# Altium project HIVE_BOARD.PrjPcb (part 2 of 6)

## Sheet HIVE_BOARD_MCU.SchDoc
size Tabloid; DocumentNumber: 2; SheetNumber: 5; SheetTotal: 12; Sheet_Name: MCU; Size: 11x17
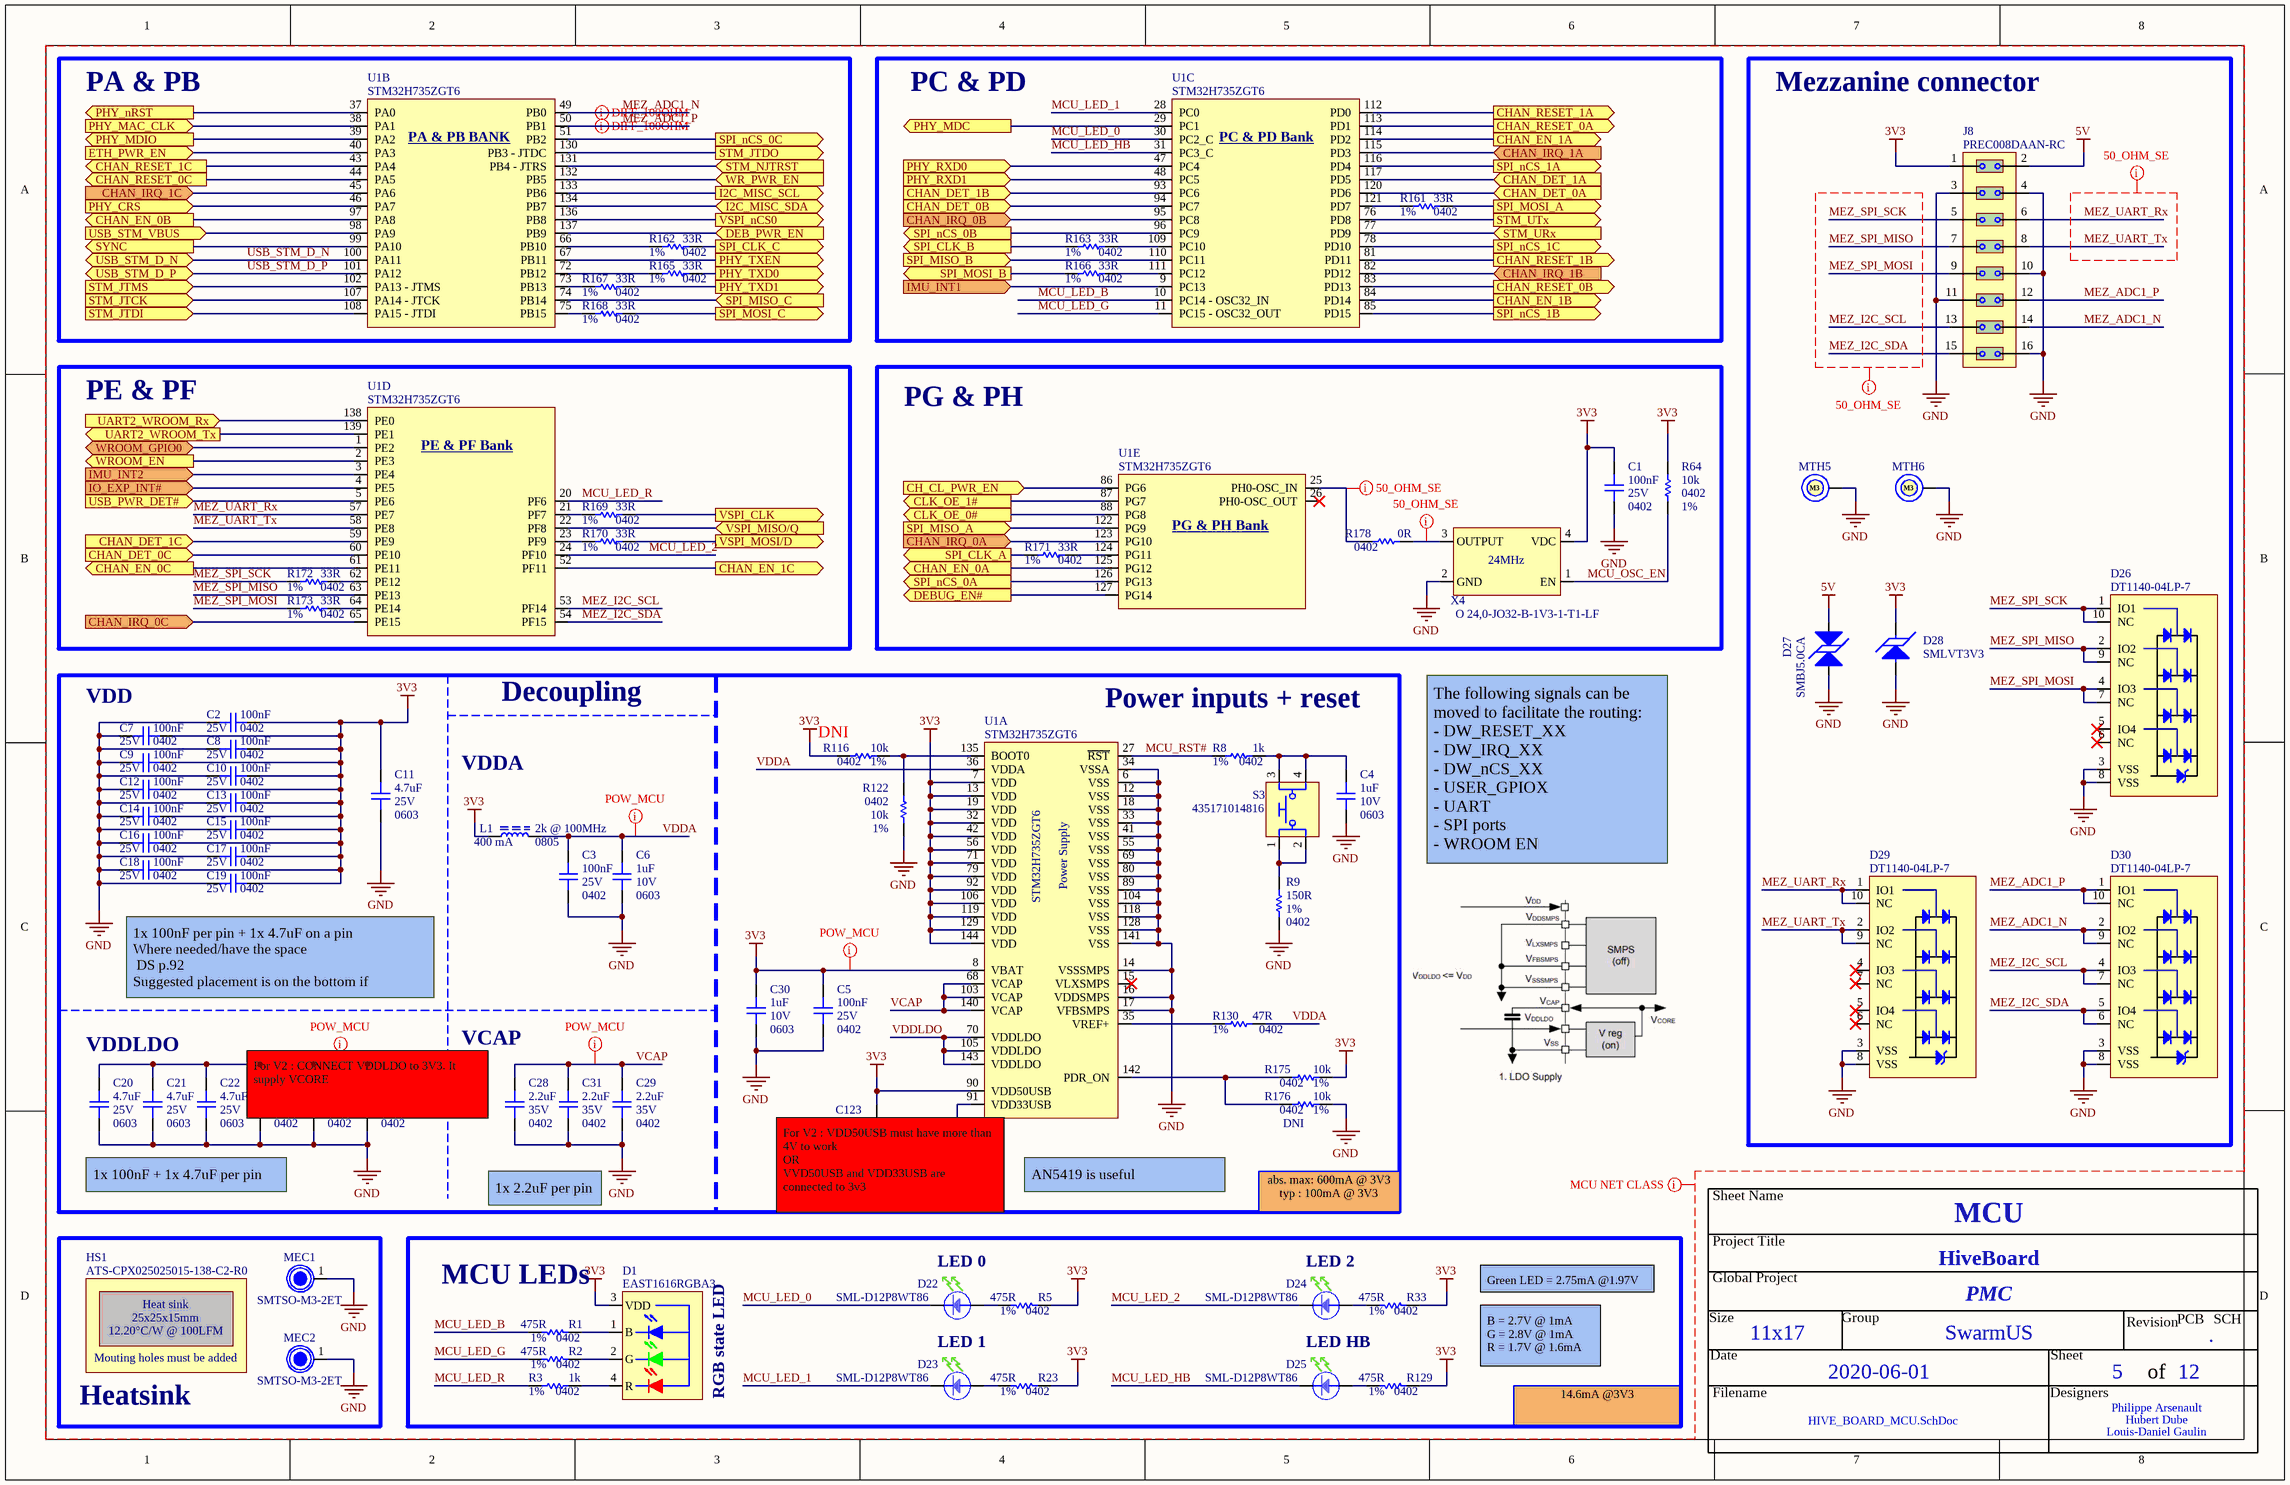
[diagram p2: HIVE_BOARD_MCU.SchDoc]

### Parts
C1  value 100nF  Package: 0402  Voltage Rating: 25V  [CAP_CER_0402]  (hidden comment: CGA2B3X7R1E104K050BB)
C2  value 100nF  Package: 0402  Voltage Rating: 25V  [CAP_CER_0402]  (hidden comment: CGA2B3X7R1E104K050BB)
C3  value 100nF  Package: 0402  Voltage Rating: 25V  [CAP_CER_0402]  (hidden comment: CGA2B3X7R1E104K050BB)
C4  value 1uF  Package: 0603  Voltage Rating: 10V  [CAP_CER_0603]  (hidden comment: C0603C105K8PACTU)
C5  value 100nF  Package: 0402  Voltage Rating: 25V  [CAP_CER_0402]  (hidden comment: CGA2B3X7R1E104K050BB)
C6  value 1uF  Package: 0603  Voltage Rating: 10V  [CAP_CER_0603]  (hidden comment: C0603C105K8PACTU)
C7  value 100nF  Package: 0402  Voltage Rating: 25V  [CAP_CER_0402]  (hidden comment: CGA2B3X7R1E104K050BB)
C8  value 100nF  Package: 0402  Voltage Rating: 25V  [CAP_CER_0402]  (hidden comment: CGA2B3X7R1E104K050BB)
C9  value 100nF  Package: 0402  Voltage Rating: 25V  [CAP_CER_0402]  (hidden comment: CGA2B3X7R1E104K050BB)
C10  value 100nF  Package: 0402  Voltage Rating: 25V  [CAP_CER_0402]  (hidden comment: CGA2B3X7R1E104K050BB)
C11  value 4.7uF  Package: 0603  Voltage Rating: 25V  [CAP_CER_0603]  (hidden comment: CL10A475MA8NQNC)
C12  value 100nF  Package: 0402  Voltage Rating: 25V  [CAP_CER_0402]  (hidden comment: CGA2B3X7R1E104K050BB)
C13  value 100nF  Package: 0402  Voltage Rating: 25V  [CAP_CER_0402]  (hidden comment: CGA2B3X7R1E104K050BB)
C14  value 100nF  Package: 0402  Voltage Rating: 25V  [CAP_CER_0402]  (hidden comment: CGA2B3X7R1E104K050BB)
C15  value 100nF  Package: 0402  Voltage Rating: 25V  [CAP_CER_0402]  (hidden comment: CGA2B3X7R1E104K050BB)
C16  value 100nF  Package: 0402  Voltage Rating: 25V  [CAP_CER_0402]  (hidden comment: CGA2B3X7R1E104K050BB)
C17  value 100nF  Package: 0402  Voltage Rating: 25V  [CAP_CER_0402]  (hidden comment: CGA2B3X7R1E104K050BB)
C18  value 100nF  Package: 0402  Voltage Rating: 25V  [CAP_CER_0402]  (hidden comment: CGA2B3X7R1E104K050BB)
C19  value 100nF  Package: 0402  Voltage Rating: 25V  [CAP_CER_0402]  (hidden comment: CGA2B3X7R1E104K050BB)
C20  value 4.7uF  Package: 0603  Voltage Rating: 25V  [CAP_CER_0603]  (hidden comment: CL10A475MA8NQNC)
C21  value 4.7uF  Package: 0603  Voltage Rating: 25V  [CAP_CER_0603]  (hidden comment: CL10A475MA8NQNC)
C22  value 4.7uF  Package: 0603  Voltage Rating: 25V  [CAP_CER_0603]  (hidden comment: CL10A475MA8NQNC)
C23  value 100nF  Package: 0402  Voltage Rating: 25V  [CAP_CER_0402]  (hidden comment: CGA2B3X7R1E104K050BB)
C24  value 100nF  Package: 0402  Voltage Rating: 25V  [CAP_CER_0402]  (hidden comment: CGA2B3X7R1E104K050BB)
C25  value 100nF  Package: 0402  Voltage Rating: 25V  [CAP_CER_0402]  (hidden comment: CGA2B3X7R1E104K050BB)
C28  value 2.2uF  Package: 0402  Voltage Rating: 35V  [CAP_CER_0402]  (hidden comment: C1005X5R1V225K050BC)
C29  value 2.2uF  Package: 0402  Voltage Rating: 35V  [CAP_CER_0402]  (hidden comment: C1005X5R1V225K050BC)
C30  value 1uF  Package: 0603  Voltage Rating: 10V  [CAP_CER_0603]  (hidden comment: C0603C105K8PACTU)
C31  value 2.2uF  Package: 0402  Voltage Rating: 35V  [CAP_CER_0402]  (hidden comment: C1005X5R1V225K050BC)
C123  value 4.7uF  Package: 0603  Voltage Rating: 25V  [CAP_CER_0603]  (hidden comment: CL10A475MA8NQNC)
D1  EAST1616RGBA3  [DIO_EAST1616RGBA3]
D22  SML-D12P8WT86  [LED_SML-D12P8WT86]
D23  SML-D12P8WT86  [LED_SML-D12P8WT86]
D24  SML-D12P8WT86  [LED_SML-D12P8WT86]
D25  SML-D12P8WT86  [LED_SML-D12P8WT86]
D26  DT1140-04LP-7  [TVS_DATA_DT1140-04LP-7]
D27  SMBJ5.0CA  [TVS_PWR_SMBJ5.0CA]
D28  SMLVT3V3  [TVS_POW_SMLVT3V3]
D29  DT1140-04LP-7  [TVS_DATA_DT1140-04LP-7]
D30  DT1140-04LP-7  [TVS_DATA_DT1140-04LP-7]
HS1  ATS-CPX025025015-138-C2-R0  [THE_HS_ATS-CPX025025015-138-C2-R0_NOMH]
J8  PREC008DAAN-RC  [CON_HDR_PREC008DAAN-RC]
L1  value 2k @ 100MHz  Current Rating: 400 mA  Package: 0805  [FER_0805]  (hidden comment: MMZ2012Y202BT000)
MEC1  SMTSO-M3-2ET  [MEC_PEM_SMTSO-M3-2ET]
MEC2  SMTSO-M3-2ET  [MEC_PEM_SMTSO-M3-2ET]
MTH5  M3  [MTH_M3]  (no BOM)
MTH6  M3  [MTH_M3]  (no BOM)
R1  value 475R  Tolerance: 1%  Package: 0402  [RES_0402]  (hidden comment: ERJ-2RKF4750X)
R2  value 475R  Tolerance: 1%  Package: 0402  [RES_0402]  (hidden comment: ERJ-2RKF4750X)
R3  value 1k  Tolerance: 1%  Package: 0402  [RES_0402]  (hidden comment: RC0402FR-071KL)
R5  value 475R  Tolerance: 1%  Package: 0402  [RES_0402]  (hidden comment: ERJ-2RKF4750X)
R8  value 1k  Tolerance: 1%  Package: 0402  [RES_0402]  (hidden comment: RC0402FR-071KL)
R9  value 150R  Tolerance: 1%  Package: 0402  [RES_0402]  (hidden comment: RC0402FR-07150RL)
R23  value 475R  Tolerance: 1%  Package: 0402  [RES_0402]  (hidden comment: ERJ-2RKF4750X)
R33  value 475R  Tolerance: 1%  Package: 0402  [RES_0402]  (hidden comment: ERJ-2RKF4750X)
R64  value 10k  Tolerance: 1%  Package: 0402  [RES_0402]  (hidden comment: RC0402FR-0710KL)
R116  value 10k  Tolerance: 1%  Assembly Note: DNI  Package: 0402  [RES_0402]  (hidden comment: RC0402FR-0710KL)
R122  value 10k  Tolerance: 1%  Package: 0402  [RES_0402]  (hidden comment: RC0402FR-0710KL)
R129  value 475R  Tolerance: 1%  Package: 0402  [RES_0402]  (hidden comment: ERJ-2RKF4750X)
R130  value 47R  Tolerance: 1%  Package: 0402  [RES_0402]  (hidden comment: RC0402FR-0747RL)
R161  value 33R  Tolerance: 1%  Package: 0402  [RES_0402]  (hidden comment: RC0402FR-0733RL)
R162  value 33R  Tolerance: 1%  Package: 0402  [RES_0402]  (hidden comment: RC0402FR-0733RL)
R163  value 33R  Tolerance: 1%  Package: 0402  [RES_0402]  (hidden comment: RC0402FR-0733RL)
R165  value 33R  Tolerance: 1%  Package: 0402  [RES_0402]  (hidden comment: RC0402FR-0733RL)
R166  value 33R  Tolerance: 1%  Package: 0402  [RES_0402]  (hidden comment: RC0402FR-0733RL)
R167  value 33R  Tolerance: 1%  Package: 0402  [RES_0402]  (hidden comment: RC0402FR-0733RL)
R168  value 33R  Tolerance: 1%  Package: 0402  [RES_0402]  (hidden comment: RC0402FR-0733RL)
R169  value 33R  Tolerance: 1%  Package: 0402  [RES_0402]  (hidden comment: RC0402FR-0733RL)
R170  value 33R  Tolerance: 1%  Package: 0402  [RES_0402]  (hidden comment: RC0402FR-0733RL)
R171  value 33R  Tolerance: 1%  Package: 0402  [RES_0402]  (hidden comment: RC0402FR-0733RL)
R172  value 33R  Tolerance: 1%  Package: 0402  [RES_0402]  (hidden comment: RC0402FR-0733RL)
R173  value 33R  Tolerance: 1%  Package: 0402  [RES_0402]  (hidden comment: RC0402FR-0733RL)
R175  value 10k  Tolerance: 1%  Package: 0402  [RES_0402]  (hidden comment: RC0402FR-0710KL)
R176  value 10k  Tolerance: 1%  Assembly Note: DNI  Package: 0402  [RES_0402]  (hidden comment: RC0402FR-0710KL)
R178  value 0R  Package: 0402  [RES_0402]  (hidden comment: RC0402FR-070RL)
S3  435171014816  [SWI_TACT_435171014816]
U1  STM32H735ZGT6  [MCU_STM32H735ZGT6]  (parts A,B,C,D,E of 5)
X4  O 24,0-JO32-B-1V3-1-T1-LF  [OSC_O 24,0-JO32-B-1V3-1-T1-LF]

### Blocks framed on the sheet
PA & PB: R162 R165 R167 R168 U1
PC & PD: R161 R163 R166 U1
Mezzanine connector: D26-D30 J8 MTH5 MTH6
PE & PF: R169 R170 R172 R173 U1
PG & PH: C1 R64 R171 R178 U1 X4
Heatsink: HS1 MEC1 MEC2
MCU LEDs: D1 D22-D25 R1-R3 R5 R23 R33 R129

### Ports
CH_CL_PWR_EN (in), CHAN_DET_0A (in), CHAN_DET_0B (in), CHAN_DET_0C (in), CHAN_DET_1A (in), CHAN_DET_1B (in), CHAN_DET_1C (in), CHAN_EN_0A (out), CHAN_EN_0B (out), CHAN_EN_0C (out), CHAN_EN_1A (out), CHAN_EN_1B (out), CHAN_EN_1C (out), CHAN_IRQ_0A (in), CHAN_IRQ_0B (in), CHAN_IRQ_0C (in), CHAN_IRQ_1A (in), CHAN_IRQ_1B (in), CHAN_IRQ_1C (in), CHAN_RESET_0A (out), CHAN_RESET_0B (out), CHAN_RESET_0C (out), CHAN_RESET_1A (out), CHAN_RESET_1B (out), CHAN_RESET_1C (out), CLK_OE_0# (out), CLK_OE_1# (out), DEB_PWR_EN (in), DEBUG_EN# (out), ETH_PWR_EN (in), I2C_MISC_SCL (out), I2C_MISC_SDA (bidir), IMU_INT1 (in), IMU_INT2 (in), IO_EXP_INT# (in), PHY_CRS (in), PHY_MAC_CLK (in), PHY_MDC (out), PHY_MDIO (out), PHY_nRST (out), PHY_RXD0 (in), PHY_RXD1 (in), PHY_TXD0 (out), PHY_TXD1 (out), PHY_TXEN (out), SPI_CLK_A (out), SPI_CLK_B (out), SPI_CLK_C (out), SPI_MISO_A (in), SPI_MISO_B (in), SPI_MISO_C (in), SPI_MOSI_A (out), SPI_MOSI_B (out), SPI_MOSI_C (out), SPI_nCS_0A (out), SPI_nCS_0B (out), SPI_nCS_0C (out), SPI_nCS_1A (out), SPI_nCS_1B (out), SPI_nCS_1C (out), STM_JTCK (in), STM_JTDI (in), STM_JTDO (out), STM_JTMS (in), STM_NJTRST (in), STM_URx (in), STM_UTx (out), SYNC (out), UART2_WROOM_Rx (in), UART2_WROOM_Tx (out), USB_PWR_DET# (in), USB_STM_D_N (bidir), USB_STM_D_P (bidir), USB_STM_VBUS (in), VSPI_CLK (out), VSPI_MISO/Q (in), VSPI_MOSI/D (out), VSPI_nCS0 (out), WR_PWR_EN (in), WROOM_EN (out), WROOM_GPIO0 (bidir)

### Nets
3V3: C1.2 C2.1 C5.2 C7.1 C8.1 C9.1 C10.1 C11.2 C12.1 C13.1 C14.1 C15.1 C16.1 C17.1 C18.1 C19.1 C30.1 C123.2 D1.3(VDD) D28.K J8.1 L1.1 R5.1 R23.1 R33.1 R64.1 R116.1 R129.1 R175.2 U1.7(VDD) U1.8(VBAT) U1.13(VDD) U1.19(VDD) U1.32(VDD) U1.42(VDD) U1.56(VDD) U1.71(VDD) U1.79(VDD) U1.90(VDD50USB) U1.92(VDD) U1.106(VDD) U1.119(VDD) U1.129(VDD) U1.144(VDD) X4.4(VDC)
5V: D27.1 J8.2
GND: C1.1 C2.2 C3.1 C4.2 C5.1 C6.2 C7.2 C8.2 C9.2 C10.2 C11.1 C12.2 C13.2 C14.2 C15.2 C16.2 C17.2 C18.2 C19.2 C20.1 C21.1 C22.1 C23.1 C24.1 C25.1 C28.1 C29.1 C30.2 C31.1 C123.1 D26.3(VSS) D26.8(VSS) D27.2 D28.A D29.3(VSS) D29.8(VSS) D30.3(VSS) D30.8(VSS) J8.3 J8.4 J8.10 J8.11 J8.16 MEC1.1 MEC2.1 MTH5.1 MTH6.1 R9.1 R122.2 R176.2 U1.6(VSS) U1.12(VSS) U1.14(VSSSMPS) U1.16(VDDSMPS) U1.17(VFBSMPS) U1.18(VSS) U1.33(VSS) U1.34(VSSA) U1.41(VSS) U1.55(VSS) U1.69(VSS) U1.80(VSS) U1.89(VSS) U1.91(VDD33USB) U1.104(VSS) U1.118(VSS) U1.128(VSS) U1.141(VSS) X4.2(GND)
CH_CL_PWR_EN: U1.86(PG6) ; port CH_CL_PWR_EN
CHAN_DET_0A: U1.120(PD6) ; port CHAN_DET_0A
CHAN_DET_0B: U1.94(PC7) ; port CHAN_DET_0B
CHAN_DET_0C: U1.60(PE10) ; port CHAN_DET_0C
CHAN_DET_1A: U1.117(PD5) ; port CHAN_DET_1A
CHAN_DET_1B: U1.93(PC6) ; port CHAN_DET_1B
CHAN_DET_1C: U1.59(PE9) ; port CHAN_DET_1C
CHAN_EN_0A: U1.125(PG12) ; port CHAN_EN_0A
CHAN_EN_0B: U1.97(PA8) ; port CHAN_EN_0B
CHAN_EN_0C: U1.61(PE11) ; port CHAN_EN_0C
CHAN_EN_1A: U1.114(PD2) ; port CHAN_EN_1A
CHAN_EN_1B: U1.84(PD14) ; port CHAN_EN_1B
CHAN_EN_1C: U1.52(PF11) ; port CHAN_EN_1C
CHAN_IRQ_0A: U1.123(PG10) ; port CHAN_IRQ_0A
CHAN_IRQ_0B: U1.95(PC8) ; port CHAN_IRQ_0B
CHAN_IRQ_0C: U1.65(PE15) ; port CHAN_IRQ_0C
CHAN_IRQ_1A: U1.115(PD3) ; port CHAN_IRQ_1A
CHAN_IRQ_1B: U1.82(PD12) ; port CHAN_IRQ_1B
CHAN_IRQ_1C: U1.45(PA6) ; port CHAN_IRQ_1C
CHAN_RESET_0A: U1.113(PD1) ; port CHAN_RESET_0A
CHAN_RESET_0B: U1.83(PD13) ; port CHAN_RESET_0B
CHAN_RESET_0C: U1.44(PA5) ; port CHAN_RESET_0C
CHAN_RESET_1A: U1.112(PD0) ; port CHAN_RESET_1A
CHAN_RESET_1B: U1.81(PD11) ; port CHAN_RESET_1B
CHAN_RESET_1C: U1.43(PA4) ; port CHAN_RESET_1C
CLK_OE_0#: U1.88(PG8) ; port CLK_OE_0#
CLK_OE_1#: U1.87(PG7) ; port CLK_OE_1#
DEB_PWR_EN: U1.132(PB5) ; port WR_PWR_EN
ETH_PWR_EN: U1.40(PA3) ; port ETH_PWR_EN
I2C_MISC_SCL: U1.133(PB6) ; port I2C_MISC_SCL
I2C_MISC_SDA: U1.134(PB7) ; port I2C_MISC_SDA
IMU_INT1: U1.9(PC13) ; port IMU_INT1
IMU_INT2: U1.3(PE4) ; port IMU_INT2
IO_EXP_INT#: U1.4(PE5) ; port IO_EXP_INT#
MCU_LED_0: D22.K U1.30(PC2_C)
MCU_LED_1: D23.K U1.28(PC0)
MCU_LED_2: D24.K U1.24(PF10)
MCU_LED_B: R1.2 U1.10(PC14_-_OSC32_IN)
MCU_LED_G: R2.2 U1.11(PC15_-_OSC32_OUT)
MCU_LED_HB: D25.K U1.31(PC3_C)
MCU_LED_R: R3.2 U1.20(PF6)
MCU_OSC_EN: R64.2 X4.1(EN)
MCU_RST#: R8.2 U1.27(~{RST})
MEZ_ADC1_N: D30.2(IO2) D30.9(NC) J8.14 U1.49(PB0)
MEZ_ADC1_P: D30.1(IO1) D30.10(NC) J8.12 U1.50(PB1)
MEZ_I2C_SCL: D30.4(IO3) D30.7(NC) J8.13 U1.53(PF14)
MEZ_I2C_SDA: D30.5(IO4) D30.6(NC) J8.15 U1.54(PF15)
MEZ_SPI_MISO: D26.2(IO2) D26.9(NC) J8.7 U1.63(PE13)
MEZ_SPI_MOSI: D26.4(IO3) D26.7(NC) J8.9 R173.2
MEZ_SPI_SCK: D26.1(IO1) D26.10(NC) J8.5 R172.2
MEZ_UART_Rx: D29.1(IO1) D29.10(NC) J8.6 U1.57(PE7)
MEZ_UART_Tx: D29.2(IO2) D29.9(NC) J8.8 U1.58(PE8)
PHY_nRST: U1.37(PA0) ; port PHY_nRST
SPI_CLK_A: R171.2 ; port SPI_CLK_A
SPI_CLK_B: R163.2 ; port SPI_CLK_B
SPI_CLK_C: R162.1 ; port SPI_CLK_C
SPI_MISO_A: U1.122(PG9) ; port SPI_MISO_A
SPI_MISO_B: U1.110(PC11) ; port SPI_MISO_B
SPI_MISO_C: U1.74(PB14) ; port SPI_MISO_C
SPI_MOSI_A: R161.1 ; port SPI_MOSI_A
SPI_MOSI_B: R166.2 ; port SPI_MOSI_B
SPI_MOSI_C: R168.1 ; port SPI_MOSI_C
SPI_nCS_0A: U1.126(PG13) ; port SPI_nCS_0A
SPI_nCS_0B: U1.96(PC9) ; port SPI_nCS_0B
SPI_nCS_0C: U1.51(PB2) ; port SPI_nCS_0C
SPI_nCS_1A: U1.116(PD4) ; port SPI_nCS_1A
SPI_nCS_1B: U1.85(PD15) ; port SPI_nCS_1B
SPI_nCS_1C: U1.78(PD10) ; port SPI_nCS_1C
USB_PWR_DET#: U1.5(PE6) ; port USB_PWR_DET#
USB_STM_D_N: U1.100(PA11) ; port USB_STM_D_N
USB_STM_D_P: U1.101(PA12) ; port USB_STM_D_P
VCAP: C28.2 C29.2 C31.2 U1.68(VCAP) U1.103(VCAP) U1.140(VCAP)
VDDA: C3.2 C6.1 L1.2 R130.1 U1.36(VDDA)
VDDLDO: C20.2 C21.2 C22.2 C23.2 C24.2 C25.2 U1.70(VDDLDO) U1.105(VDDLDO) U1.143(VDDLDO)
WR_PWR_EN: U1.137(PB9) ; port DEB_PWR_EN
NetC4_1: C4.1 R8.1 S3.3 S3.4
NetD1_1: D1.1(B) R1.1
NetD1_2: D1.2(G) R2.1
NetD1_4: D1.4(R) R3.1
NetD22_A: D22.A R5.2
NetD23_A: D23.A R23.2
NetD24_A: D24.A R33.2
NetD25_A: D25.A R129.2
NetJ7_2: U1.131(PB4_-_JTRS) ; port STM_NJTRST
NetJ7_4: U1.102(PA13_-_JTMS) ; port STM_JTMS
NetJ7_6: U1.130(PB3_-_JTDC) ; port STM_JTDO
NetJ7_8: U1.108(PA15_-_JTDI) ; port STM_JTDI
NetJ7_10: U1.107(PA14_-_JTCK) ; port STM_JTCK
NetR9_2: R9.2 S3.1 S3.2
NetR16_2: U1.98(PA9) ; port USB_STM_VBUS
NetR18_2: U1.47(PC4) ; port PHY_RXD0
NetR19_2: U1.48(PC5) ; port PHY_RXD1
NetR38_2: U1.2(PE3) ; port WROOM_EN
NetR45_1: U1.39(PA2) ; port PHY_MDIO
NetR47_2: U1.46(PA7) ; port PHY_CRS
NetR48_2: U1.38(PA1) ; port PHY_MAC_CLK
NetR65_1: U1.127(PG14) ; port DEBUG_EN#
NetR116_2: R116.2 R122.1 U1.135(BOOT0)
NetR130_2: R130.2 U1.35(VREF+)
NetR161_2: R161.2 U1.121(PD7)
NetR162_2: R162.2 U1.66(PB10)
NetR163_1: R163.1 U1.109(PC10)
NetR165_1: R165.1 ; port PHY_TXD0
NetR165_2: R165.2 U1.72(PB12)
NetR166_1: R166.1 U1.111(PC12)
NetR167_1: R167.1 ; port PHY_TXD1
NetR167_2: R167.2 U1.73(PB13)
NetR168_2: R168.2 U1.75(PB15)
NetR169_1: R169.1 ; port VSPI_CLK
NetR169_2: R169.2 U1.21(PF7)
NetR170_1: R170.1 ; port VSPI_MOSI/D
NetR170_2: R170.2 U1.23(PF9)
NetR171_1: R171.1 U1.124(PG11)
NetR172_1: R172.1 U1.62(PE12)
NetR173_1: R173.1 U1.64(PE14)
NetR175_1: R175.1 R176.1 U1.142(PDR_ON)
NetR178_1: R178.1 X4.3(OUTPUT)
NetR178_2: R178.2 U1.25(PH0-OSC_IN)
NetR179_2: U1.99(PA10) ; port SYNC
NetU1_1: U1.1(PE2) ; port WROOM_GPIO0
NetU1_22: U1.22(PF8) ; port VSPI_MISO/Q
NetU1_29: U1.29(PC1) ; port PHY_MDC
NetU1_67: U1.67(PB11) ; port PHY_TXEN
NetU1_76: U1.76(PD8) ; port STM_UTx
NetU1_77: U1.77(PD9) ; port STM_URx
NetU1_136: U1.136(PB8) ; port VSPI_nCS0
NetU1_138: U1.138(PE0) ; port UART2_WROOM_Rx
NetU1_139: U1.139(PE1) ; port UART2_WROOM_Tx

Not connected (* = marked no-connect by the designer): D26 5(IO4)* 6(NC)*; D29 4(IO3)* 5(IO4)* 6(NC)* 7(NC)*; U1 15(VLXSMPS)* 26(PH0-OSC_OUT)*

### Layout directives
net class POWER; net class POW_MCU: 3V3
net class POW_MCU: VCAP, VDDA, VDDLDO
net class NETS_MCU: 3V3, 5V, GND, MCU_LED_0, MCU_LED_1, MCU_LED_2, MCU_LED_B, MCU_LED_G, MCU_LED_HB, MCU_LED_R, MCU_OSC_EN, MCU_RST#, MEZ_ADC1_N, MEZ_ADC1_P, MEZ_I2C_SCL, MEZ_I2C_SDA, MEZ_SPI_MISO, MEZ_SPI_MOSI, MEZ_SPI_SCK, MEZ_UART_Rx, MEZ_UART_Tx, USB_STM_D_N, USB_STM_D_P, VCAP, VDDA, VDDLDO
differential pair; differential pair class DIFF_100: MEZ_ADC1_N, MEZ_ADC1_P
net class SE_50: MEZ_I2C_SCL, MEZ_I2C_SDA, MEZ_SPI_MISO, MEZ_SPI_MOSI, MEZ_SPI_SCK, MEZ_UART_Rx, MEZ_UART_Tx, NetR178_1, NetR178_2

### Notes on the sheet
- (near C7) VDD
- Decoupling
- Power inputs + reset
- VDDA
- The following signals can be moved to facilitate the routing:
  - DW_RESET_XX
  - DW_IRQ_XX
  - DW_nCS_XX
  - USER_GPIOX
  - UART
  - SPI ports
  - WROOM EN
- 1x 100nF per pin + 1x 4.7uF on a pin
  Where needed/have the space
  DS p.92
  Suggested placement is on the bottom if necessary
- VDDLDO
- (near C28) VCAP
- For V2 : CONNECT VDDLDO to 3V3. It supply VCORE
- 1x 100nF + 1x 4.7uF per pin
- 1x 2.2uF per pin
- (near C123) For V2 : VDD50USB must have more than 4V to work
  OR
  VVD50USB and VDD33USB are connected to 3v3
- AN5419 is useful
- abs. max: 600mA @ 3V3
  typ : 100mA @ 3V3
- LED 0
- LED 2
- Green LED = 2.75mA @1.97V
- LED 1
- LED HB
- B = 2.7V @ 1mA
  G = 2.8V @ 1mA
  R = 1.7V @ 1.6mA
- RGB state LED
- 14.6mA @3V3
- Sheet Name
- Project Title
- Global Project
- Size
- Date
- Group
- Sheet
- Revision
- of
- PCB
- .
- SCH
- Filename
- Designers
- (in symbol MCU_STM32H735ZGT6, part A) Power Supply
- (in symbol MCU_STM32H735ZGT6, part B) PA & PB BANK
- (in symbol MCU_STM32H735ZGT6, part C) PC & PD Bank
- (in symbol MCU_STM32H735ZGT6, part D) PE & PF Bank
- (in symbol MCU_STM32H735ZGT6, part E) PG & PH Bank
- (in symbol THE_HS_ATS-CPX025025015-138-C2-R0_NOMH) Heat sink; 25x25x15mm; 12.20°C/W @ 100LFM; Mouting holes must be added
- (in symbol THE_HS_ATS-CPX025025015-138-C2-R0) Heat sink; 25x25x15mm; 12.20°C/W @ 100LFM

### Library data of the parts
C1-C3 C5 C7-C10 C12-C19 C23-C25 = CAP_CER_CGA2B3X7R1E104K050BB: CAP - CER 0.1µF 10% 25V X7R - 0402; Manufacturer #1: TDK Corporation; GRAMS Lib Spec: 2.8; Magnetic Material: Unknown; Polarized: NO; Assembly Type: SMD; CreatedBy/Date: Nicolas Roy 2018-11-07; Current Rating: *; HelpURL: https://product.tdk.com/info/en/catalog/datasheets/mlcc_automotive_general_en.pdf; Manufacturer #2: *; Note: *; Part Number #1: CGA2B3X7R1E104K050BB; Part Number #2: *; Power Max: *; Temperature: -55°C ~ 125°C; Tolerance: 10%; VerifiedBy: Nicolas V. (2019-01-22); Supplier 1: Digi-Key; Supplier Part Number 1: 445-6902-1-ND; Cryo: UNKNOWN
C4 C6 C30 = CAP_CER_C0603C105K8PACTU: CAP - CER 1uF 10V 10% X5R - 0603; Manufacturer #1: KEMET; GRAMS Lib Spec: 2.8; Magnetic Material: Unknown; Polarized: NO; Tolerance: 10%; Current Rating: *; Power Max: *; HelpURL: https://content.kemet.com/datasheets/KEM_C1006_X5R_SMD.pdf; CreatedBy/Date: Hubert Dube - 21/07/20; VerifiedBy: Louis-Daniel Gaulin - 21/07/20; Temperature: -55°C ~ 85°C; Manufacturer #2: *; Assembly Type: SMD; Part Number #2: *; Part Number #1: C0603C105K8PACTU; Cryo: UNKNOWN; Supplier 1: Digi-Key; Supplier Part Number 1: 399-3118-1-ND
C11 C20-C22 C123 = CAP_CER_CL10A475MA8NQNC: CAP - CER 4.7µF 20% 25V X5R - 0603; Manufacturer #1: Samsung Electro-Mechanics; GRAMS Lib Spec: 2.8; Magnetic Material: Unknown; Polarized: NO; Assembly Type: SMD; CreatedBy/Date: Nicolas Roy 2018-11-21; Current Rating: *; HelpURL: http://www.samsungsem.com/kr/support/product-search/mlcc/__icsFiles/afieldfile/2018/06/20/CL10A475MA8NQNC.pdf; Manufacturer #2: *; Note: *; Part Number #1: CL10A475MA8NQNC; Part Number #2: *; Power Max: *; Temperature: -55°C ~ 85°C; Tolerance: 20%; VerifiedBy: Nicolas V. (2019-01-22); Supplier 1: Digi-Key; Supplier Part Number 1: 1276-1903-1-ND; Cryo: UNKNOWN
C28 C29 C31 = CAP_CER_C1005X5R1V225K050BC: CAP - CER 2.2µF 10% 35V X5R - 0402; Manufacturer #1: TDK Corporation; GRAMS Lib Spec: 2.8; Magnetic Material: Unknown; Polarized: NO; Assembly Type: SMD; CreatedBy/Date: Nicolas Roy 2018-10-17; Current Rating: *; HelpURL: https://product.tdk.com/info/en/catalog/datasheets/mlcc_commercial_general_en.pdf; Manufacturer #2: *; Part Number #1: C1005X5R1V225K050BC; Part Number #2: *; Power Max: *; Temperature: -55°C ~ 85°C; Tolerance: 10%; VerifiedBy: Caroline Paulin - 18 janv 2018; Supplier 1: Digi-Key; Supplier Part Number 1: 445-9028-1-ND; Cryo: UNKNOWN
D1 = DIO_EAST1616RGBA3: DIO - Red, Green, Blue LED Indication - Discrete 1.95V Red, 2.8V Green, 2.8V Blue 0606 (1616 Metric); Manufacturer #1: Everlight Electronics Co Ltd; Value: 24MHz; Tolerance: ±50ppm; Voltage Rating: 1.8 to 3.3V; Current Rating: 60mA; Power Max: 60mW; GRAMS Lib Spec: 2.8; Magnetic Material: Unknown; Polarized: Yes; HelpURL: https://everlightamericas.com/index.php?controller=attachment&id_attachment=1010; CreatedBy/Date: Hubert Dube - 26/02/2021; VerifiedBy: PA + Hubert Dube - 19/03/2021; Temperature: -40 ~ +85℃; Package: 4-SMD, No Lead; Manufacturer #2: *; Note: *; Assembly Type: SMD; Part Number #2: *; Part Number #1: EAST1616RGBA3; Cryo: UNKNOWN; Supplier 1: Digi-Key; Supplier Part Number 1: 1080-1550-1-ND
D22-D25 = LED_SML-D12P8WT86: LED - GREEN DIFFUSED 0603 SMD - 0603; Manufacturer #1: Rohm Semiconductor; Current Rating: 1-20mA; Note: Operate at 2mA; Value: 560 nm (green); Voltage rating: 2.2V (Forward), 5V (max Reverse); Polarized: Yes; Magnetic Material: Unknown; GRAMS Lib Spec: 2.8; Manufacturer #2: *; Power Max: *; Part Number #1: SML-D12P8WT86; Part Number #2: *; HelpURL: https://d1d2qsbl8m0m72.cloudfront.net/en/products/databook/datasheet/opto/led/chip_mono/sml-d12x8_d13x8-e.pdf; Supplier 1: Digi-Key; Supplier Part Number 1: 511-1579-2-ND; Assembly Type: SMD; Temperature: -40 ~ 85 °C; Package: 0603; CreatedBy/Date: Keven Deslandes - 2018/11/21; Tolerance: *; VerifiedBy: Caroline Paulin - 13 février 2019; Cryo: UNKNOWN
D26 D29 D30 = TVS_DATA_DT1140-04LP-7: TVS - DIODE 5.5V 10V - 10-UFDFN; Manufacturer #1: Diodes Incorporated; Value: 5.5V @ 1mA (Reverse Standoff); Voltage Rating: 6V (Breakdown); Current Rating: 6A (8/20µs); Power Max: 60W (8/20µs); GRAMS Lib Spec: 2.8; Note: Fooprint created from tpd4e05u06 (TI) for manufacturability (soldermask); Magnetic Material: UNKNOWN; Polarized: Yes; Tolerance: -; HelpURL: https://www.diodes.com/assets/Datasheets/DT1140-04LP.pdf; CreatedBy/Date: Joël Lemay 2019-11-20; VerifiedBy: C.Paulin - 21/11/2019; Temperature: -55°C~85°C; Package: 10-UFDFN; Manufacturer #2: -; Assembly Type: SMD; Part Number #2: -; Part Number #1: DT1140-04LP-7; Supplier 1: Digi-Key; Supplier Part Number 1: DT1140-04LP-7DICT-ND; Cryo: UNKNOWN; Solder Paste Type: UNKNOWN; Stencil Thickness (Recommended): UNKNOWN
D27 = TVS_PWR_SMBJ5.0CA: TVS - BIDIR 5V 9.2V 600W - DO214AA; Manufacturer #1: Littelfuse Inc.; Value: Vbr = 6.4V -  Clamp = 9.2V; Voltage Rating: 5V Standoff; Current Rating: 65.3 A (Ipp); Power Max: 600W (Pppm); GRAMS Lib Spec: 2.8; Magnetic Material: UNKNOWN; Polarized: NO; Tolerance: *; HelpURL: http://www.littelfuse.com/~/media/electronics/datasheets/tvs_diodes/littelfuse_tvs_diode_smbj_datasheet.pdf.pdf; CreatedBy/Date: Jonathan Bouchard - 2019-03-22; VerifiedBy: Nicolas V. (2019-05-06); Temperature: -65°C ~ 150°C (TJ); Package: DO214AA; Manufacturer #2: *; Note: *; Assembly Type: SMD; Part Number #2: *; Part Number #1: SMBJ5.0CA; Supplier 1: Digi-Key; Supplier Part Number 1: SMBJ5.0CALFCT-ND; Cryo: UNKNOWN
D28 = TVS_POW_SMLVT3V3: TVS - 3.3V 10.3V 600W - DO214AA; Manufacturer #1: STMicroelectronics; Value: Vbr = 4.1V -  Clamp = 10.3V; Voltage Rating: 3.3V Standoff; Current Rating: 200A (Ifsm); Power Max: 600W (Ppp); GRAMS Lib Spec: 2.8; Magnetic Material: UNKNOWN; Polarized: YES; Tolerance: *; HelpURL: https://www.st.com/content/ccc/resource/technical/document/datasheet/da/a4/86/90/17/13/47/7c/CD00000923.pdf/files/CD00000923.pdf/jcr:content/translations/en.CD00000923.pdf; CreatedBy/Date: Jonathan Bouchard - 2019-04-27; VerifiedBy: Nicolas V. (2019-05-06); Temperature: -55°C ~ 175°C (TJ); Package: DO214AA; Manufacturer #2: *; Note: *; Assembly Type: SMD; Part Number #2: *; Part Number #1: SMLVT3V3; Supplier 1: Digi-Key; Supplier Part Number 1: 497-2496-1-ND; Cryo: UNKNOWN
HS1 = THE_HS_ATS-CPX025025015-138-C2-R0_NOMH: THE_HS - Heat Sink  25x25x15 mm - TH M3; Manufacturer #1: Advanced Thermal Solutions Inc.; Power Max: 12.20 °C/W @ 100LFM; GRAMS Lib Spec: 2.8; Magnetic Material: Unknown; Polarized: No; HelpURL: https://www.qats.com/pushPIN/DataSheet/ATS-CPX025025015-138-C2-R0; CreatedBy/Date: Philippe Arsenault/2021-04-08; VerifiedBy: Louis-Daniel Gaulin / 14-04-2021; Package: 20x20x15mm; Assembly Type: M3 Screws; Part Number #1: ATS-CPX025025015-138-C2-R0; Supplier 1: Digi-Key; Supplier Part Number 1: ATS1516-ND
J8 = CON_HDR_PREC008DAAN-RC: CON - Connector Header Through Hole 16 position 0.100" (2.54mm); Manufacturer #1: Sullins Connector Solutions; Value: 8x2; Current Rating: 3A; GRAMS Lib Spec: 2.7; Magnetic Material: Unknown; Polarized: Yes; Tolerance: *; Voltage Rating: *; Power Max: *; HelpURL: https://drawings-pdf.s3.amazonaws.com/11636.pdf; VerifiedBy: Philippe Arsenault/2021-03-25; Temperature: -40°C ~ 105°C; Package: TH 2x8; Manufacturer #2: *; Assembly Type: TH; Part Number #2: *; Part Number #1: PREC008DAAN-RC; CreatedBy/Date: Hubert Dube -  16/03/2021; Supplier 1: Digi-Key; Supplier Part Number 1: S2012EC-08-ND
L1 = FER_MMZ2012Y202BT000: FER - FERRITE BEAD 2 KOHM @ 100 MHz 400 mA - 0805; Manufacturer #1: TDK Corporation; GRAMS Lib Spec: 2.8; Magnetic Material: Unknown; Polarized: No; Tolerance: *; Voltage Rating: *; Power Max: *; HelpURL: https://product.tdk.com/info/en/catalog/datasheets/beads_commercial_signal_mmz2012_en.pdf; CreatedBy/Date: Hubert Dube - 7/02/2021; VerifiedBy: Philippe Arsenault/ 2021-03-13; Temperature: -55°C ~ 125°C; Assembly Type: SMD; Part Number #2: *; Part Number #1: MMZ2012Y202BT000; Cryo: UNKNOWN; Supplier 1: Digi-Key; Supplier Part Number 1: 445-1561-1-ND
MEC1 MEC2 = MEC_PEM_SMTSO-M3-2ET: MEC- PEM SMD THREADED SPACER M3 - SMD; Manufacturer #1: PENN ENGINEERING; GRAMS Lib Spec: 2.7; Magnetic Material: Unknown; Polarized: NO; Value: M3; Tolerance: -; Voltage Rating: -; Current Rating: *; Power Max: -; HelpURL: http://catalog.pemnet.com/item/uts-and-spacers-standoffs-surface-mount-type-smtso/nt-nuts-and-spacers-standoffs-br-type-smtso-metric/smtso-m3-2et; CreatedBy/Date: Gabriel St-H./30-04-2019; VerifiedBy: Nicolas V. (2019-05-02); Temperature: -; Package: SMD; Manufacturer #2: *; Note: *; Assembly Type: SMD; Part Number #2: *; Part Number #1: SMTSO-M3-2ET; Supplier 1: PENN ENGINEERING; Supplier Part Number 1: SMTSO-M3-2ET; Cryo: UNKNOWN
MTH5 MTH6 = MTH_M3: MTH - MOUNTING HOLE M3 PLATED - M3; GRAMS Lib Spec: 2.8; Magnetic Material: NO; Cryo: UNKNOWN; Value: *; Tolerance: *; Voltage Rating: *; Current Rating: *; Power Max: *; HelpURL: https://littlemachineshop.com/images/gallery/PDF/TapDrillSizes.pdf; CreatedBy/Date: Jonathan Bouchard 2018-07-23; VerifiedBy: Arnaud Samson 23-07-18; Temperature: *; Package: M3; Manufacturer #1: *; Manufacturer #2: *; Note: *; Assembly Type: NONE; Part Number #2: *; Part Number #1: *; Polarized: *; Supplier 1: *; Supplier Part Number 1: *
R1 R2 R5 R23 R33 R129 = RES_ERJ-2RKF4750X: RES - 475R 1% 1/10W- 0402; Manufacturer #1: Panasonic Electronic Components; GRAMS Lib Spec: 2.8; Power Max: 1/10W; Magnetic Material: Unknown; Polarized: No; Voltage Rating: 50V; Assembly Type: SMD; CreatedBy/Date: Keven Deslandes 2018-10-17; Current Rating: *; HelpURL: https://industrial.panasonic.com/cdbs/www-data/pdf/RDA0000/AOA0000C304.pdf; Manufacturer #2: *; Part Number #1: ERJ-2RKF4750X; Part Number #2: *; Temperature: -55°C ~ 155°C; VerifiedBy: Carolilne Paulin - 18/12/2018; Supplier 1: Digi-Key; Supplier Part Number 1: P475LCT-ND; Cryo: UNKNOWN
R3 R8 = RES_RC0402FR-071KL: RES - 1K OHM 1% 1/16W - 0402; Manufacturer #1: Yageo; GRAMS Lib Spec: 2.8; Magnetic Material: YES; Polarized: NO; Voltage Rating: 50V; Cryo: UNKNOWN; Assembly Type: SMD; CreatedBy/Date: Jonathan Bouchard 2018-07-05; Current Rating: *; HelpURL: http://www.yageo.com/documents/recent/PYu-RC_Group_51_RoHS_L_9.pdf; Manufacturer #2: *; Note: *; Part Number #1: RC0402FR-071KL; Part Number #2: *; Power Max: 1/16W; Temperature: -55°C ~ 155°C; VerifiedBy: Arnaud Samson 16-07-18; Supplier 1: Digi-Key; Supplier Part Number 1: 311-1.00KLRCT-ND
R9 = RES_RC0402FR-07150RL: RES - 150R 1% 1/16W - 0402; Manufacturer #1: Yageo; GRAMS Lib Spec: 2.8; Magnetic Material: Unknown; Polarized: No; Voltage Rating: 50V; Assembly Type: SMD; CreatedBy/Date: Jonathan Bouchard 2019-03-25; Current Rating: *; HelpURL: http://www.yageo.com/documents/recent/PYu-RC_Group_51_RoHS_L_10.pdf; Manufacturer #2: *; Part Number #1: RC0402FR-07150RL; Part Number #2: *; Power Max: 1/16W; Temperature: -55°C ~ 155°C; VerifiedBy: Nicolas V. (2019-05-02); Supplier 1: Digi-Key; Supplier Part Number 1: 311-150LRCT-ND; Cryo: UNKNOWN
R64 R116 R122 R175 R176 = RES_RC0402FR-0710KL: RES - 10K OHMS 1% 1/16W - 0402; Manufacturer #1: Yageo; GRAMS Lib Spec: 2.8; Magnetic Material: UNKNOWN; Polarized: NO; Voltage Rating: 50V; Assembly Type: SMD; CreatedBy/Date: Nicolas V. (2018-11-20); Current Rating: *; HelpURL: http://www.yageo.com/documents/recent/PYu-RC_Group_51_RoHS_L_9.pdf; Manufacturer #2: *; Note: *; Part Number #1: RC0402FR-0710KL; Part Number #2: *; Power Max: 1/16W; Temperature: -55°C ~ 155°C; VerifiedBy: Nicolas V. (2018-11-20); Supplier 1: Digi-Key; Supplier Part Number 1: 311-10.0KLRCT-ND; Cryo: UNKNOWN
  R64: Solder Paste Type: UNKNOWN; Stencil Thickness (Recommended): UNKNOWN
R130 = RES_RC0402FR-0747RL: RES -  47ohm ±1% 0.063W, 1/16W Chip Resistor 0402; Manufacturer #1: Yageo; GRAMS Lib Spec: 2.8; Magnetic Material: Unknown; Polarized: No; Voltage Rating: 50V; Assembly Type: SMD; CreatedBy/Date: Philippe Arsenault/2021-04-10; Current Rating: *; HelpURL: https://www.yageo.com/upload/media/product/productsearch/datasheet/rchip/PYu-RC_Group_51_RoHS_L_11.pdf; Manufacturer #2: *; Note: *; Part Number #1: RC0402FR-0747RL; Part Number #2: *; Power Max: 1/16W; Temperature: -55°C ~ 155°C; VerifiedBy: Louis-Daniel Gaulin / 14-04-2021; Supplier 1: Digi-Key; Supplier Part Number 1: 311-47.0LRCT-ND
R161-R163 R165-R173 = RES_RC0402FR-0733RL: RES - 33 OHM 1% 1/16W - 0402; Manufacturer #1: Yageo; GRAMS Lib Spec: 2.8c; Magnetic Material: Unknown; Polarized: NO; Voltage Rating: 50V; Assembly Type: SMD; CreatedBy/Date: Louis-Daniel Gaulin/ 14/01/2020; Current Rating: *; HelpURL: https://www.yageo.com/upload/media/product/productsearch/datasheet/rchip/PYu-RC_Group_51_RoHS_L_10.pdf; Manufacturer #2: *; Note: *; Part Number #1: RC0402FR-0733RL; Part Number #2: *; Power Max: 1/16W; Temperature: -55°C ~ 155°C; VerifiedBy: C.Paulin - 21/01/2020; Supplier 1: Digi-Key; Supplier Part Number 1: 311-33.0LRCT-ND; Cryo: UNKNOWN
R178 = RES_RC0402FR-070RL: RES - 0R 1/16W 1A  - 0402; Manufacturer #1: Yageo; GRAMS Lib Spec: 2.8; Magnetic Material: Unknown; Polarized: No; Voltage Rating: 50V; Assembly Type: SMD; CreatedBy/Date: Keven Deslandes 2018-09-12; Current Rating: 1A; HelpURL: http://www.yageo.com/documents/recent/PYu-RC_Group_51_RoHS_L_10.pdf; Manufacturer #2: *; Note: *; Part Number #1: RC0402FR-070RL; Part Number #2: *; Power Max: 1/16W; Temperature: -55°C ~ 155°C; VerifiedBy: Caroline Paulin - 27 fév 2019; Supplier 1: Digi-Key; Supplier Part Number 1: 311-0.0LRCT-ND; Cryo: UNKNOWN
S3 = SWI_TACT_435171014816: SWI - SWITCH TACTILE SPST-NO 0.05A 12V -SMD; Manufacturer #1: Würth Elektronik; Current Rating: 50mA; Voltage rating: 12VDC; Polarized: No; Magnetic Material: UNKNOWN; GRAMS Lib Spec: 2.8; Manufacturer #2: *; Power Max: *; Value: SPST-NO; Part Number #1: 435171014816; Part Number #2: *; HelpURL: https://www.we-online.com/catalog/datasheet/435171014816.pdf; Supplier 1: Digi-Key; Supplier Part Number 1: 732-435171014816CT-ND; Assembly Type: SMD; Temperature: -40°C ~ 85°C; Package: SMD; CreatedBy/Date: Hubert Dube - 22/07/20; Tolerance: *; VerifiedBy: Louis-Daniel Gaulin / 12-11-2020; Cryo: UNKNOWN
U1 = MCU_STM32H735ZGT6: ARM® Cortex®-M7 series Microcontroller IC 32-Bit 550MHz 1MB (1M x 8) FLASH 564K RAM - 144-LQFP (20x20); Manufacturer #1: STMicroelectronics; Value: 550MHz MCU; Voltage Rating: 1.62V ~ 3.6V; Current Rating: 620mA; Power Max: 2.2W; GRAMS Lib Spec: 2.8; Magnetic Material: Unknown; Polarized: Yes; HelpURL: https://www.st.com/resource/en/datasheet/stm32h735ag.pdf; CreatedBy/Date: Philippe Arsenault/2021-04-08; VerifiedBy: Louis-Daniel Gaulin / 08-04-2021; Temperature: -40°C ~ 85°C (TA); Package: 144-LQFP (20x20); Assembly Type: SMD; Part Number #1: STM32H735ZGT6; Supplier 1: Digi-Key; Supplier Part Number 1: 497-STM32H735ZGT6-ND
X4 = OSC_O 24,0-JO32-B-1V3-1-T1-LF: OSC - 24MHz XO (Standard) LVCMOS Oscillator 1.8V ~ 3.3V Enable/Disable 4-SMD, No Lead; Manufacturer #1: Jauch Quartz; Tolerance: ±50ppm; Current Rating: 4mA; Power Max: 13mW; GRAMS Lib Spec: 2.8c; Magnetic Material: Unknown; Polarized: Yes; Value: 24MHz; Voltage Rating: 1.8V ~ 3.3V; HelpURL: https://www.jauch.com/downloadfile/5ef1edcfb8e2f73163c8ce8009ef659d1/jo32-1.8-3.3v.pdf; CreatedBy/Date: Louis-Daniel Gaulin / 13-04-2021; VerifiedBy: Philippe Arsenault/2021-04-14; Temperature: -40°C ~ +85°C; Package: 4-SMD, No Lead; Manufacturer #2: *; Note: *; Assembly Type: SMD; Part Number #2: *; Part Number #1: O 24,0-JO32-B-1V3-1-T1-LF; Cryo: UNKNOWN; Supplier 1: Digi-Key; Supplier Part Number 1: 1908-O240-JO32-B-1V3-1-T1-LFCT-ND